# Altium project DriveWire_V1_Spin1.PrjPcb
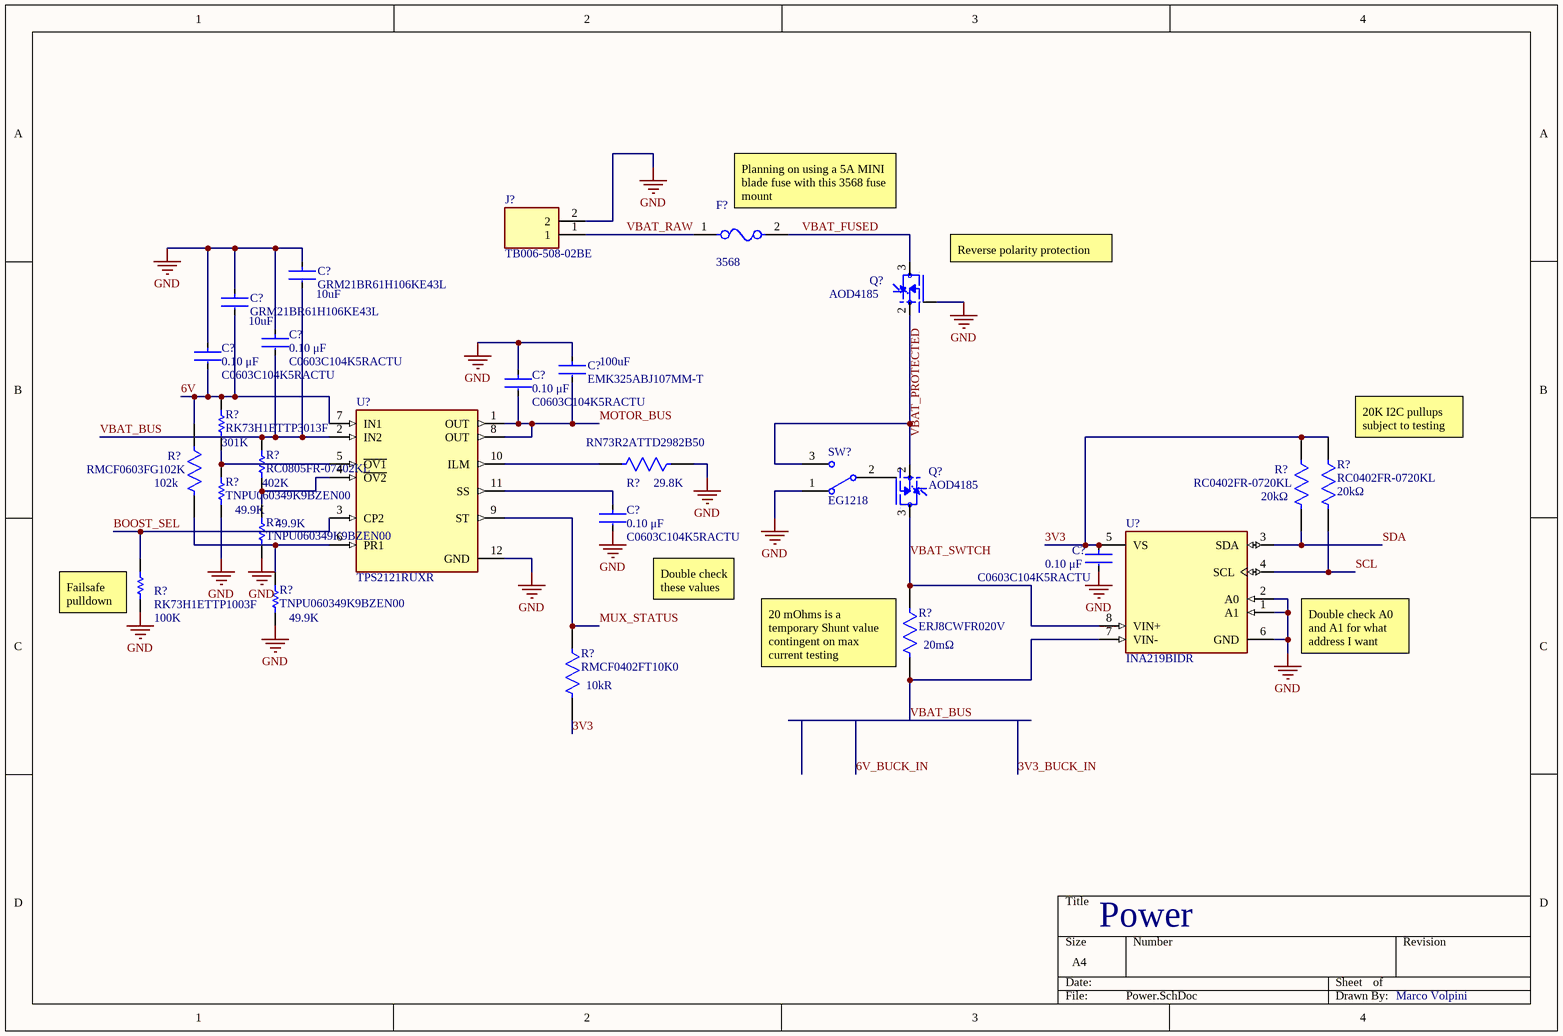
[diagram p0: Power.SchDoc]
3 sheets, 33 parts. Net scope: global (net labels, ports and power ports of the same name join across sheets).
Sheets:
  ESP32.SchDoc
  Power.SchDoc
  buck_converters.SchDoc

## Sheet ESP32.SchDoc
size A4; SheetNumber: 1; SheetTotal: 1

## Sheet Power.SchDoc
size A4; SheetNumber: 2; SheetTotal: 3

### Parts
(Parts that share a designator on the sheet are numbered #1, #2 ... from top to bottom, then left to right.)
C?#1  GRM21BR61H106KE43L  Capacitance: 10uF  [FP-GRM21B-0_2-e0_2_0_7-IPC_A]
C?#2  GRM21BR61H106KE43L  Capacitance: 10uF  [FP-GRM21B-0_2-e0_2_0_7-IPC_A]
C?#3  C0603C104K5RACTU  Capacitance: 0.10 μF  [FP-C0603C-CF-MFG]
C?#4  C0603C104K5RACTU  Capacitance: 0.10 μF  [FP-C0603C-CF-MFG]
C?#5  EMK325ABJ107MM-T  Capacitance: 100uF  [FP-EMK325A-M-MFG]
C?#6  C0603C104K5RACTU  Capacitance: 0.10 μF  [FP-C0603C-CF-MFG]
C?#7  C0603C104K5RACTU  Capacitance: 0.10 μF  [FP-C0603C-CF-MFG]
C?#8  C0603C104K5RACTU  Capacitance: 0.10 μF  [FP-C0603C-CF-MFG]
F?  3568  [FP-3568-MFG]
J?  TB006-508-02BE  [CUI_TB006-508-02BE]
Q?#1  AOD4185  [TO252]
Q?#2  AOD4185  [TO252]
R?#1  RMCF0603FG102K  Resistance: 102k  [FP-RMCF0603-IPC_A]
R?#2  RK73H1ETTP3013F  Resistance: 301K  [RESC1005X40X25NL10T10]
R?#3  RC0402FR-0720KL  Resistance: 20kΩ  [FP-RC0402-0_4-MFG]
R?#4  RC0402FR-0720KL  Resistance: 20kΩ  [FP-RC0402-0_4-MFG]
R?#5  RN73R2ATTD2982B50  Resistance: 29.8K  [FP-RN73R2A-IPC_B]
R?#6  RC0805FR-07402KL  Resistance: 402K  [RESC2013X60X35NL10T20]
R?#7  TNPU060349K9BZEN00  Resistance: 49.9K  [RESC1609X55X30ML10T20]
R?#8  TNPU060349K9BZEN00  Resistance: 49.9K  [RESC1609X55X30ML10T20]
R?#9  ERJ8CWFR020V  Resistance: 20mΩ  [FP-ERJ8CW-MFG]
R?#10  RK73H1ETTP1003F  Resistance: 100K  [RESC1005X40X25NL10T10]
R?#11  TNPU060349K9BZEN00  Resistance: 49.9K  [RESC1609X55X30ML10T20]
R?#12  RMCF0402FT10K0  Resistance: 10kR  [FP-RMCF0402-IPC_C]
SW?  EG1218  [ESWI-EG1218_V]
U?#1  TPS2121RUXR  [FP-RUX0012A-MFG]
U?#2  INA219BIDR  [FP-D0008A-MFG]

### Nets
GND: C?#1.1 C?#2.1 C?#3.1 C?#4.1 C?#5.2 C?#6.1 C?#7.2 C?#8.2 J?.2 Q?#1.1(G) R?#5.1 R?#7.1 R?#8.1 R?#10.1 R?#11.1 SW?.1 U?#1.12(GND) U?#2.1(A1) U?#2.2(A0) U?#2.6(GND)
3V3: C?#8.1 R?#3.1 R?#4.1 R?#12.2 U?#2.5(VS)
6V: C?#2.2 C?#4.2 R?#1.1 R?#2.2 U?#1.7(IN1)
BOOST_SEL: R?#10.2 U?#1.3(CP2)
MOTOR_BUS: C?#5.1 C?#6.2 U?#1.1(OUT) U?#1.8(OUT)
MUX_STATUS: R?#12.1 U?#1.9(ST)
SCL: R?#4.2 U?#2.4(SCL)
SDA: R?#3.2 U?#2.3(SDA)
VBAT_BUS: C?#1.2 C?#3.2 R?#6.2 R?#9.2 U?#1.2(IN2) U?#2.7(VIN-)
VBAT_FUSED: F?.2 Q?#1.3(D)
VBAT_RAW: F?.1 J?.1
VBAT_SWTCH: Q?#2.3(D) R?#9.1 U?#2.8(VIN+)
NetC?#7_1: C?#7.1 U?#1.11(SS)
NetQ?#1_2: Q?#1.2(S) Q?#2.2(S) SW?.3
NetQ?#2_1: Q?#2.1(G) SW?.2(COM)
NetR?#1_2: R?#1.2 R?#11.2 U?#1.6(PR1)
NetR?#2_1: R?#2.1 R?#7.2 U?#1.5(~{OV1})
NetR?#5_2: R?#5.2 U?#1.10(ILM)
NetR?#6_1: R?#6.1 R?#8.2 U?#1.4(~{OV2})

### Notes on the sheet
- (near F?) Planning on using a 5A MINI blade fuse with this 3568 fuse mount
- (near Q?#1) Reverse polarity protection PMOS -> body diode brings up source voltage to open channel and allow low resistance path for current, but stays off and body diode reverse biased with incorrect polarity
- (near R?#4) 20K I2C pullups subject to testing
- (near R?#10) Failsafe pulldown
- (near C?#7) Double check these values
- Double check A0 and A1 for what address I want
- (near R?#9) 20 mOhms is a temporary Shunt value contingent on max current testing
- Power
- Marco Volpini
- Labels drawn without touching a wire or pin: VBAT_PROTECTED

### Library data of the parts
C?#1 C?#2 = CMP-06035-004402-1: Chip Multilayer Ceramic Capacitors for General Purpose, 0805, 10uF, X5R, 15%, 10%, 50V; Voltage Rating (DC): 50V; Dielectric: X5R; Tolerance: 10%; Thickness: 1.25mm; Length: 2mm; Width: 1.25mm
C?#3 C?#4 C?#6-C?#8 = CMP-2006-03061-2: CAP CER 0.1UF 50V X7R 0603; Manufacturer: KEMET; Tolerance: 0.1; Temperature Coefficient: 30ppm/°C; Material: Ceramic; Automotive Grade: Grade 1; Value: 0.10 μF; Temperature: -55°C to +125°C; RoHS: TRUE; Temperature Range High: +125°C; Lead Free: Yes; Octopart: https://octopart.com/c0603c104k5ractu-kemet-139244; Digikey Description: CAP CER 0.1UF 50V X7R 0603; Category: Cap; Package: C0603C-CF; ComponentLink2Description: Datasheet; Temperature Range Low: -55°C; Device Class L1: Passive Components; Voltage Rating: 50 V; Automotive: Yes; Device Class L3: Ceramic Capacitors; ComponentLink2URL: https://api.kemet.com/component-edge/download/datasheet/C0603C100J5GACAUTO.pdf; Device Class L2: Capacitors; Manufacturer Part Number: C0603C104K5RACTU; Temperature Characteristic: X7R; Height: 0.87mm
C?#5 = CMP-2000-05020-2: CAP CER 100UF 16V X5R 1210; Manufacturer: Taiyo Yuden; Material: Ceramic; Temperature Coefficient: 15%; Tolerance: 20%; Ipc Land Pattern Name: CAPC320250X250; Package: EMK325A-M; Device Class L1: Passive Components; Height: 2.8mm; Device Class L2: Capacitors; Temperature Range Low: -55°C; RoHS: TRUE; Temperature Characteristic: X5R; Mouser Description: 1210 100 uF 16 V ±20% Tolerance X5R SMT Multilayer Ceramic Capacitor; ComponentLink2Description: Datasheet; Temperature: -55°C to +85°C; Device Class L3: Ceramic Capacitors; Lead Free: Yes; Category: Cap; Octopart: https://octopart.com/emk325abj107mm-t-taiyo+yuden-20815747; Temperature Range High: +85°C; Automotive: No; Manufacturer Part Number: EMK325ABJ107MM-T; Value: 100uF; Digikey Description: CAP CER 100UF 16V X5R 1210; Voltage Rating: 16V; ComponentLink2URL: https://www.yuden.co.jp/productdata/catalog/mlcc01_e.pdf
F? = CMP-2000-05464-2: NexarPartId: 8116161; Approvals: UL; Body Material: Nylon; Illumination Type: Illuminated; Voltage Rating (AC): 500V; Current Rating: 20A; Number of Poles: 1; Color: Black; Material: Brass, Nylon, Tin; Depth: 6.73mm; Max Operating Temperature: 145°C; Length: 16mm; Mount: PCB, Vertical; REACH SVHC: No SVHC; Lead Free: Lead Free; Min Operating Temperature: -50°C; Flammability Rating: UL94 V-0; RoHS: Compliant; Orientation: Vertical; Fuse Current: 20A; Termination: PC Pin; Number of Circuits: 1; Contact Plating: Tin; Voltage: 500V; Contact Material: Brass
J? = TB006-508-02BE: 2~24 Poles, Screw Type, Horizontal, 5.08 Pitch, 26~14 (AWG), Terminal Block Connector; MF: Same Sky; SnapEDA_Link: https://www.snapeda.com/parts/TB006-508-02BE/Same+Sky/view-part/?ref=snap; Package: None; Value: *; MP: TB006-508-02BE; Check_prices: https://www.snapeda.com/parts/TB006-508-02BE/Same+Sky/view-part/?ref=eda; Supplier 1: Arrow Electronics; Supplier Part Number 1: TB006-508-02BE
Q?#1 Q?#2 = AOD4185: P-Channel 40V 40A (Tc) 2.5W (Ta), 62.5W (Tc) Surface Mount TO-252, (D-Pak); MF: Alpha &; SnapEDA_Link: https://www.snapeda.com/parts/AOD4185/Alpha+%2526+Omega+Semiconductor+Inc./view-part/?ref=snap; Package: TO-252 Alpha &amp; Omega Semiconductor; Value: *; MP: AOD4185; Check_prices: https://www.snapeda.com/parts/AOD4185/Alpha+%2526+Omega+Semiconductor+Inc./view-part/?ref=eda
R?#1 = CMP-26527-000784-1: 102kΩ ±1% 0.1W 0603 Thick Film Chip Resistor AEC-Q200 compliant; Max Power Dissipation: 100mW; Temperature Coefficient: 100ppm/°C; Packaging: Tape and Reel; Package Quantity: 10000; Mount: Surface Mount; Case Code (Imperial): 0603; Width: 0.031inch; Radiation Hardening: No; Number of Terminations: 2; Min Operating Temperature: -55°C; Max Operating Temperature: 155°C; Resistor Type: Thick Film; Contact Plating: Tin; Lead Free: Lead Free; Case/Package: 0603; Features: Automotive AEC-Q200; Case Code (Metric): 1608; RoHS Compliant: Yes; Series: RMCF; Length: 0.061inch; Tolerance: 1%; Height: 0.022inch
R?#2 = CMP-2002-03895-1: Manufacturer: KOA Speer; Part Number: RK73H1ETTP3013F
R?#3 R?#4 = CMP-2002-07501-2: NexarPartId: 39794396; Max Power Dissipation: 63mW; Voltage Rating: 50V; Temperature Coefficient: 100ppm/°C; Power Rating: 62.5mW; Tolerance: 1%; Termination: SMD/SMT; Features: Moisture Resistant; Max Operating Temperature: 155°C; Number of Pins: 2; Length: 1mm; Min Operating Temperature: -55°C; RoHS: Compliant; Width: 500µm; Composition: Thick Film; Case/Package: 0402; Depth: 500µm; Lead Free: Lead Free; Height: 350µm; Packaging: Tape & Reel; Military Standard: Not; Case Code (Imperial): 0402; Case Code (Metric): 1005; Schedule B: 8533210045, 8533210045; Number of Terminations: 2; Voltage Rating (DC): 50V; REACH SVHC: No SVHC
R?#5 = CMP-04015-062765-1: 29.8kΩ ±0.1% 0.125W, 1/8W Chip Resistor 0805 (2012 Metric) Moisture Resistant Thin Film
R?#6 = CMP-2001-01136-1: Manufacturer: Yageo; Part Number: RC0805FR-07402KL
R?#7 R?#8 R?#11 = CMP-2000-03683-1: Manufacturer: Vishay Dale; Part Number: TNPU060349K9BZEN00
R?#9 = CMP-2003-00793-2: NexarPartId: 24259294; Power Rating: 1W; Temperature Coefficient: 50ppm/°C; Tolerance: 1%; Packaging: Cut Tape; Width: 1.6002mm; Number of Terminations: 2; Depth: 1.6mm; Termination: Flat; Min Operating Temperature: -55°C; RoHS: Compliant; Lead Free: Lead Free; Lifecycle Status: Production; Case/Package: 1206; Case Code (Metric): 3216; Mount: Surface Mount; Max Power Dissipation: 1W; Features: Automotive AEC-Q200; Height: 750µm; Schedule B: 8533210045, 8533210045; Length: 3.2004mm; Max Operating Temperature: 125°C; Composition: Thick Film; REACH SVHC: No SVHC; Case Code (Imperial): 1206
R?#10 = CMP-2002-04173-1: Manufacturer: KOA Speer; Part Number: RK73H1ETTP1003F
R?#12 = CMP-26527-000128-1: 10kΩ ±1% 0.063W 0402 Thick Film Chip Resistor AEC-Q200 compliant; Temperature Coefficient: 100ppm/°C; Power Rating: 62.5mW; Max Power Dissipation: 63mW; Width: 0.02inch; Case/Package: 0402; Depth: 0.5mm; Resistor Type: Thick Film; Series: RMCF; Length: 1mm; Contact Plating: Tin; Tolerance: 1%; Number of Terminations: 2; Height: 0.016inch; Military Standard: Not; Case Code (Imperial): 0402; Size Code: 0402; Construction: Rectangular; Radiation Hardening: No; RoHS Compliant: Yes; Case Code (Metric): 1005; Packaging: Tape and Reel; Lead Free: Lead Free; Min Operating Temperature: -55°C; Max Operating Temperature: 155°C; Mount: Surface Mount; Features: Automotive AEC-Q200
SW? = CMP-1696-00002-1: Slide Switch, 500 V, -20 to 70 degC, 3-Pin THD, RoHS; Case\Package: SOT-23-5; Output Current: 150 mA; Nominal Output Voltage: 3.3 V; Max Power Dissipation: 250 mW; Min Input Voltage: 4.3 V; Outputs: 1; Max Input Voltage: 8 V; Dropout Voltage: 300 mV; PackageDescription: 3-Pin Through Hole Device, Body 11.6 x 4 mm, Pitch 2.5 mm; ComponentLink1URL: http://www.e-switch.ch/en/; RoHSCompliant: true; Length: 3 mm; ComponentLink1Description: Manufacturer URL; Power Rating: 250 mW; Mount: Surface Mount; Max Operating Temperature: 85 degC; REACH SVHC: No SVHC; Radiation Hardening: No; Height: 1.3 mm; Pins: 5; Max Ouput Current: 150 mA; Output Voltage: 3.3 V; Width: 1.8 mm; Package Quantity: 3000; ComponentLink2URL: https://www.e-switch.com/system/asset/product_line/data_sheet/119/EG.pdf; Min Operating Temperature: -40 degC; ComponentLink2Description: Datasheet; DatasheetVersion: Oct-15; PackageReference: EG1218; Packaging: Tape and Reel
U?#1 = CMP-04910-000009-1: PWR MGMT BATTERY MGMT; Manufacturer: Texas Instruments; Min Supply Voltage: 2.8V; Max Junction Temp: +125°C; Output Voltage: 22V; Output Current: 1.5-5.2A; Standoff Height: 0mm; Number Of Outputs: 1; Nominal Supply Current: 300uA; Device Class L2: Power Management ICs; Octopart: https://octopart.com/tps2121ruxr-texas+instruments-95511053; Mouser Description: 2.7-22V, 56m?, 4.5A, Priority Power MUX with Seamless Switchover 12-VQFN-HR -40 to 125; Lead Free: Yes; Digikey Description: PWR MGMT BATTERY MGMT; Manufacturer Part Number: TPS2121RUXR; Height: 1mm; Device Class L1: Integrated Circuits (ICs); Category: IC; Max Supply Voltage: 22V; ComponentLink2Description: Datasheet; Temperature: -40°C to +125°C; Temperature Range High: +125°C; ComponentLink2URL: https://www.ti.com/lit/ds/symlink/tps2121.pdf; Automotive: No; Package: RUX0012A; RoHS: TRUE; Device Class L3: unset; Temperature Range Low: -40°C
U?#2 = CMP-0704-00005-3: IC MONITOR PWR/CURR BIDIR 8-SOIC; Min Supply Voltage: 3V; Common Mode Rejection Ratio: 100dB; Output Current: 10mA; Number of Amplifiers: 1; Accuracy: 0.5%; Supply Current: 1mA; Quiescent Current: 700uA; Bandwidth: 11kHz; Input Offset Voltage (Vos): 40uV; Max Supply Voltage: 5.5V; Packaging: Tape and Reel; REACH SVHC: No SVHC; Max Operating Temperature: 125°C; Number of Pins: 8; Lead Free: Lead Free; Package Quantity: 1; Radiation Hardening: No; Case/Package: SOIC; Min Operating Temperature: -40°C; Contact Plating: Gold; Series: Zero-Drift; Nominal Supply Current: 1mA; RoHS Compliant: Yes; ComponentLink1Description: DigiKey; ComponentLink1URL: https://www.digikey.ca/en/products/detail/texas-instruments/INA219BIDR/2426057

## Sheet buck_converters.SchDoc
size A4; SheetNumber: 3; SheetTotal: 3
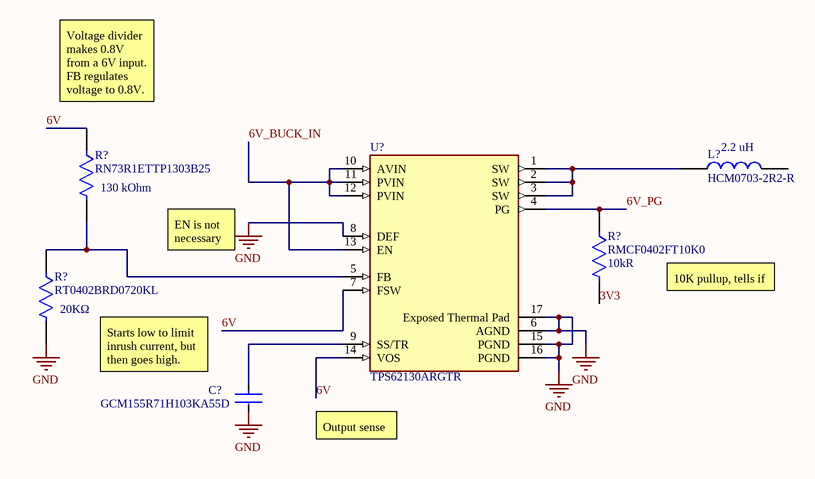
[diagram p1: buck_converters.SchDoc]

### Parts
(Parts that share a designator on the sheet are numbered #1, #2 ... from top to bottom, then left to right.)
C?#9  GCM155R71H103KA55D  [FP-GCM155-0_05-IPC_C]
L?  HCM0703-2R2-R  Inductance: 2.2 uH  [INDPM7166X300N]
R?#13  RN73R1ETTP1303B25  Parameter 1: 130 kOhm  [FP-RN73R1E-IPC_B]
R?#14  RMCF0402FT10K0  Resistance: 10kR  [FP-RMCF0402-IPC_C]
R?#15  RT0402BRD0720KL  Resistance: 20KΩ  [FP-RT0402-MFG]
U?#3  TPS62130ARGTR  [FP-RGT0016C-MFG]

### Nets
GND: C?#9.2 R?#15.2 U?#3.6(AGND) U?#3.8(DEF) U?#3.15(PGND) U?#3.16(PGND) U?#3.17(Exposed_Thermal_Pad)
3V3: R?#14.2
6V: R?#13.1 U?#3.7(FSW) U?#3.14(VOS)
6V_BUCK_IN: U?#3.10(AVIN) U?#3.11(PVIN) U?#3.12(PVIN) U?#3.13(EN)
6V_PG: R?#14.1 U?#3.4(PG)
NetC?#9_1: C?#9.1 U?#3.9(SS/TR)
NetL?_1: L?.1 U?#3.1(SW) U?#3.2(SW) U?#3.3(SW)
NetR?#13_2: R?#13.2 R?#15.1 U?#3.5(FB)

Not connected (* = marked no-connect by the designer): L? 2

### Notes on the sheet
- Voltage divider makes 0.8V from a 6V input. FB regulates voltage to 0.8V.
- EN is not necessary and added complexity since the motor driver has control as well
- 10K pullup, tells if voltage falls too low
- Starts low to limit inrush current, but then goes high.
  goes from 2.5 MHz -> 1.25 MHz
- Output sense

### Library data of the parts
C?#9 = CMP-2008-03723-3: Ceramic Capacitor for Automotive 10nF ±10% 50VDC X7R 0402 Paper T/R; Voltage Rating (DC): 50V; Min Operating Temperature: -55°C; Radiation Hardening: No; Mount: Surface Mount; Thickness: 0.022inch; Package Quantity: 1; Case Code (Imperial): 0402; Lead Free: Lead Free; Case/Package: 0402; Depth: 0.5mm; Termination: SMD/SMT; Tolerance: 10%; Voltage: 50V; Packaging: Tape and Reel; Width: 0.02inch; REACH SVHC: No SVHC; Height: 0.5mm; Max Operating Temperature: 125°C; Case Code (Metric): 1005; Voltage Rating: 50V; Capacitance: 10nF; Ratings: AEC-Q200; Length: 1mm; Dielectric: X7R
L? = HCM0703-2R2-R: High current carrying capacity  Low core losses  Magnetically shielded, low EMI  Frequency range up to 5 MHz  Inductance range from 0.15 uH to 33 uH  Current range from 1.8 A to 52 A  7.4 mm x 6.8 mm footprint surface mount package in a 3.0 mm height  Iron powder core material; Manufacturer_Name: Eaton; Geometry.Height: 3mm; Manufacturer_Part_Number: HCM0703-2R2-R; Mouser Part Number: 704-HCM0703-2R2-R; Mouser Price/Stock: https://www.mouser.co.uk/ProductDetail/Coiltronics-Eaton/HCM0703-2R2-R?qs=NDsWxPllFnNWXZwyaLK1bg%3D%3D; Arrow Part Number: HCM0703-2R2-R; Arrow Price/Stock: null?region=nac; Datasheet Link: https://www.mouser.fr/datasheet/2/87/eaton_hcm0703_high_current_power_inductors_data_sh-1608742.pdf
R?#13 = CMP-04015-027314-1: 130kΩ ±0.1% 0.063W, 1/16W Chip Resistor 0402 (1005 Metric) Moisture Resistant Thin Film
R?#14 = CMP-26527-000128-1: as R?#12 on sheet Power; Width: 0.02inch; Case/Package: 0402; Depth: 0.5mm; Resistor Type: Thick Film; Series: RMCF; Length: 1mm; Contact Plating: Tin; Tolerance: 1%; Number of Terminations: 2; Height: 0.016inch; Military Standard: Not; Case Code (Imperial): 0402; Size Code: 0402; Construction: Rectangular; Radiation Hardening: No; RoHS Compliant: Yes; Case Code (Metric): 1005; Packaging: Tape and Reel; Lead Free: Lead Free; Min Operating Temperature: -55°C; Max Operating Temperature: 155°C; Mount: Surface Mount; Features: Automotive AEC-Q200
R?#15 = CMP-2002-02936-2: RES SMD 20K OHM 0.1% 1/16W 0402; Manufacturer: Yageo; Power Rating: 0.063W; Value: 20KΩ; Tolerance: 0.001; Voltage Rating: 50V; Description: RT0402 20KΩ 0.063W 25 ppm/°C 0.10%; Temperature Coefficient: 25 ppm/°C; ComponentLink2Description: Datasheet; Footprint Url: http://www.yageo.com/exep/pages/download/literatures/PYu-R_Mount_10.pdf; Automotive: No; Manufacturer Part Number: RT0402BRD0720KL; Temperature Range Low: -55°C; Octopart: https://octopart.com/rt0402brd0720kl-yageo-1422805; Digikey Description: RES SMD 20K OHM 0.1% 1/16W 0402; Device Class L3: Chip SMD Resistors; Series: RT; Composition: Thin Film; Temperature: -55°C to +155°C; Lead Free: Yes; Height: 0.35mm; Package: RT0402; Mouser Description: Res Thin Film 0402 20K Ohm 0.1% 1/16W ±25ppm/°C Molded SMD SMD Paper T/R; Ipc Land Pattern Name: RESC10050X30; RoHS: TRUE; Device Class L1: Passive Components; Category: Res; Temperature Range High: +155°C; Device Class L2: Resistors; ComponentLink2URL: http://www.yageo.com/documents/recent/PYu-RT_1-to-0.01_RoHS_L_9.pdf
U?#3 = CMP-04918-000067-1: IC REG BUCK ADJUSTABLE 3A 16QFN; Manufacturer: Texas Instruments; Min Supply Voltage: 3V; Max Junction Temp: +125°C; Standoff Height: 0mm; Max Duty Cycle: 100%; Max Supply Voltage: 17V; Nominal Supply Current: 17uA; Number Of Outputs: 1; Output Type: AdjustableProgrammable; Switching Frequency: 1250-2500kHz; Output Voltage: 0.9-6V; Automotive: No; Height: 1mm; Device Class L2: Power Management ICs; Output Current: 3A; Digikey Description: IC REG BUCK ADJUSTABLE 3A 16QFN; Temperature: -40°C to +125°C; Temperature Range High: +125°C; Octopart: https://octopart.com/tps62130argtr-texas+instruments-29716940; Switching Topology: Buck; Lead Free: Yes; Temperature Range Low: -40°C; Category: IC; Mouser Description: 3-V to 17-V, 3-A step-down converter with DCS-control in 3x3 QFN package 16-VQFN -40 to 125; ComponentLink2URL: http://www.ti.com/lit/ds/symlink/tps62130a.pdf; Package: RGT0016C; Device Class L1: Integrated Circuits (ICs); RoHS: TRUE; Manufacturer Part Number: TPS62130ARGTR; Device Class L3: Voltage Regulators - Switching; ComponentLink2Description: Datasheet

## Nets that join several sheets
GND: Power (20 pins), buck_converters (7 pins)
3V3: Power (5 pins), buck_converters (R?#14.2)
6V: Power (5 pins), buck_converters (R?#13.1 U?#3.7 U?#3.14)